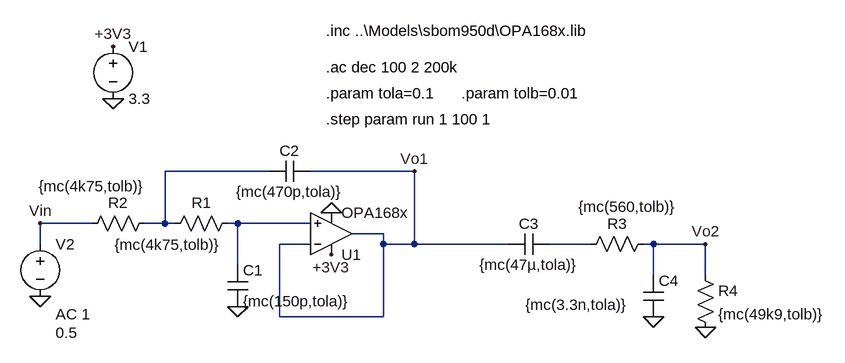
[diagram p0: schematic filtroDAC.asc]
filtroDAC.asc, the LTspice schematic file:
Version 4
SHEET 1 880 680
WIRE -48 272 -208 272
WIRE 176 272 16 272
WIRE -320 352 -400 352
WIRE -208 352 -208 272
WIRE -208 352 -240 352
WIRE -192 352 -208 352
WIRE -96 352 -112 352
WIRE 16 352 -96 352
WIRE 128 368 80 368
WIRE -400 384 -400 352
WIRE 16 384 -32 384
WIRE 128 384 128 368
WIRE 176 384 176 272
WIRE 176 384 128 384
WIRE 320 384 176 384
WIRE 448 384 384 384
WIRE 544 384 528 384
WIRE 624 384 544 384
WIRE -96 416 -96 352
WIRE 544 432 544 384
WIRE 624 432 624 384
WIRE -32 496 -32 384
WIRE 128 496 128 384
WIRE 128 496 -32 496
FLAG -288 160 0
FLAG -288 80 +3V3
FLAG 48 336 0
FLAG 48 400 +3V3
FLAG -400 464 0
FLAG -96 480 0
FLAG -400 352 Vin
FLAG 176 272 Vo1
FLAG 544 496 0
FLAG 624 512 0
FLAG 624 384 Vo2
SYMBOL OpAmps\\opamp2 48 432 M180
SYMATTR InstName U1
SYMATTR Value OPA168x
SYMBOL voltage -288 64 R0
WINDOW 123 0 0 Left 0
WINDOW 39 0 0 Left 0
SYMATTR InstName V1
SYMATTR Value 3.3
SYMBOL cap -112 416 R0
SYMATTR InstName C1
SYMATTR Value {mc(150p,tola)}
SYMBOL res -96 336 R90
WINDOW 0 0 56 VBottom 2
WINDOW 3 33 108 VTop 2
SYMATTR InstName R1
SYMATTR Value {mc(4k75,tolb)}
SYMBOL res -224 336 R90
WINDOW 0 0 56 VBottom 2
WINDOW 3 -57 97 VTop 2
SYMATTR InstName R2
SYMATTR Value {mc(4k75,tolb)}
SYMBOL cap 16 256 R90
WINDOW 0 0 32 VBottom 2
WINDOW 3 32 32 VTop 2
SYMATTR InstName C2
SYMATTR Value {mc(470p,tola)}
SYMBOL voltage -400 368 R0
WINDOW 3 24 152 Left 2
WINDOW 123 24 124 Left 2
WINDOW 39 0 0 Left 0
SYMATTR Value 0.5
SYMATTR Value2 AC 1
SYMATTR InstName V2
SYMBOL cap 384 368 R90
WINDOW 0 0 32 VBottom 2
WINDOW 3 32 32 VTop 2
SYMATTR InstName C3
SYMATTR Value {mc(47µ,tola)}
SYMBOL res 544 368 R90
WINDOW 0 0 56 VBottom 2
WINDOW 3 -57 40 VTop 2
SYMATTR InstName R3
SYMATTR Value {mc(560,tolb)}
SYMBOL cap 528 432 R0
WINDOW 3 -181 45 Left 2
SYMATTR Value {mc(3.3n,tola)}
SYMATTR InstName C4
SYMBOL res 608 416 R0
SYMATTR InstName R4
SYMATTR Value {mc(49k9,tolb)}
TEXT 40 56 Left 2 !.inc ..\\Models\\sbom950d\\OPA168x.lib
TEXT 40 112 Left 2 !.ac dec 100 2 200k
TEXT 40 152 Left 2 !.param tola=0.1
TEXT 40 192 Left 2 !.step param run 1 100 1
TEXT 248 152 Left 2 !.param tolb=0.01

The netlist it stands for:
* filtroDAC.asc
XU1 N002 Vo1 +3V3 0 Vo1 OPA168x  ; pins In+ In- V+ V- OUT
V1 +3V3 0 3.3
C1 N002 0 {mc(150p,tola)}
R1 N002 N001 {mc(4k75,tolb)}
R2 N001 Vin {mc(4k75,tolb)}
C2 Vo1 N001 {mc(470p,tola)}
V2 Vin 0 0.5 AC 1
C3 N003 Vo1 {mc(47µ,tola)}
R3 Vo2 N003 {mc(560,tolb)}
C4 Vo2 0 {mc(3.3n,tola)}
R4 Vo2 0 {mc(49k9,tolb)}
.inc ..\Models\sbom950d\OPA168x.lib
.ac dec 100 2 200k
.param tola=0.1
.step param run 1 100 1
.param tolb=0.01
.backanno
.end